# Altium schematic sheet USB OTG.SchDoc: USG OTG
size A4; Date: 30 08 2013; Author: Rachid AKKOUCHE; CompanyName: RASoftware; DrawnBy: Rachid AKKOUCHE; Engineer: Rachid AKKOUCHE; Organization: RASoftware; Address1: 52 J03, rue de la crèche; Address2: 77100 MEAUX; Address3: FRANCE; DocumentNumber: BRA2013083010C; Revision: C; SheetNumber: 10; SheetTotal: 11; Telephone: +33651604047; Email: rachid.akkouche@wanadoo.fr; Proprietaire: MDI System; Dessinepar: -; Verifiepar: -; Time: 19:30
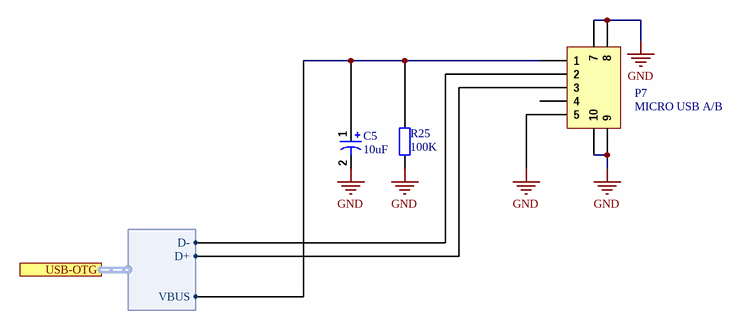
[diagram p0: USB OTG.SchDoc]

## Parts
C5  10uF  [KEMET_4]  (no BOM)
P7  MICRO USB A/B  [USB FCI 10104111]  (no BOM)
R25  100K  [R0805]

## Ports
USB-OTG (harness USG-OTG)

## Harnesses
USG-OTG: D-, D+, VBUS

## Nets
GND: C5.2 P7.5 P7.7 P7.8 P7.9 P7.10 R25.1
NetC5_1: C5.1 P7.1 R25.2 ; port USB-OTG.VBUS
NetP7_2: P7.2 ; port USB-OTG.D-
NetP7_3: P7.3 ; port USB-OTG.D+

Not connected (* = marked no-connect by the designer): P7 4

## Notes on the sheet
- Ce document est la propriété de
- Project:
- Il ne peut être divulgué sans l'accord écrit de l'un de ses représentants dûment mandaté
- Title:
- Number:
- Date:
- Time:
- Size:
- A4
- Revision:
- Sheet
- of
- 52 J03 rue de la crèche
- Draw by:
- 77100 Meaux

## Library data of the parts
C5 = Cap Pol1: Polarized Capacitor; Manufacturer: KEMET; Manufacturer Part Number: EXV106M025A9BAA; Supplier 1: Farnell; Supplier Part Number 1: 2069174; RoHS: YES; Pricing 1: 10=0,111, 100=0,085, 500=0,074, 1000=0,07, 5000=0,066 (EUR); ComponentLink1URL: http://www.farnell.com/datasheets/1500293.pdf; ComponentLink1Description: http://www.farnell.com/datasheets/1500293.pdf
P7 = Header 5: Header, 5-Pin; Manufacturer: FCI; Manufacturer Part Number: 10104111-0001LF; Type de connecteur: USB Micro A/B; Série: 10104111; Genre: Embase; Nombre de contacts: 5; Terminaison du contact: Montage en surface à angle droit; Montage connecteur: CI; Plaquage du contact: Or; Matériau du contact: Cuivre; SVHC: No SVHC (20-Jun-2013); LatestRevisionDate: 17-Jul-2002; LatestRevisionNote: Re-released for DXP Platform.; Publisher: Altium Limited; Supplier 1: Farnell; Supplier Part Number 1: 2293755; RoHS: YES; Pricing 1: 1=0,98, 10=0,84, 25=0,76, 50=0,67, 100=0,64, 250=0,57 (EUR); ComponentLink1URL: http://portal.fciconnect.com/Comergent//fci/drawing/10104111.pdf; ComponentLink1Description: http://portal.fciconnect.com/Comergent//fci/drawing/10104111.pdf
R25 = Resistor 0805 100K: Resistor; Manufacturer: MULTICOMP; Manufacturer Part Number: MC0.1W08051%100KFR; Product Range: MULTICOMP - MC Series; Résistance: 100; Tolérance de résistance: ± 1%; Type de boîtier de résistance: 0805; Type de résistance: Couche épaisse; Coefficient de température: ± 100; Tension: 150; Type de packaging: Full Reel; Resistor Mounting: CMS; Supplier 1: Farnell; Supplier Part Number 1: 2129276; RoHS: YES; Pricing 1: 5000=0,001 (EUR); Puissance: 100; MSL: MSL 1 - Illimité; ComponentLink1URL: http://www.farnell.com/datasheets/1716700.pdf; ComponentLink1Description: http://www.farnell.com/datasheets/1716700.pdf